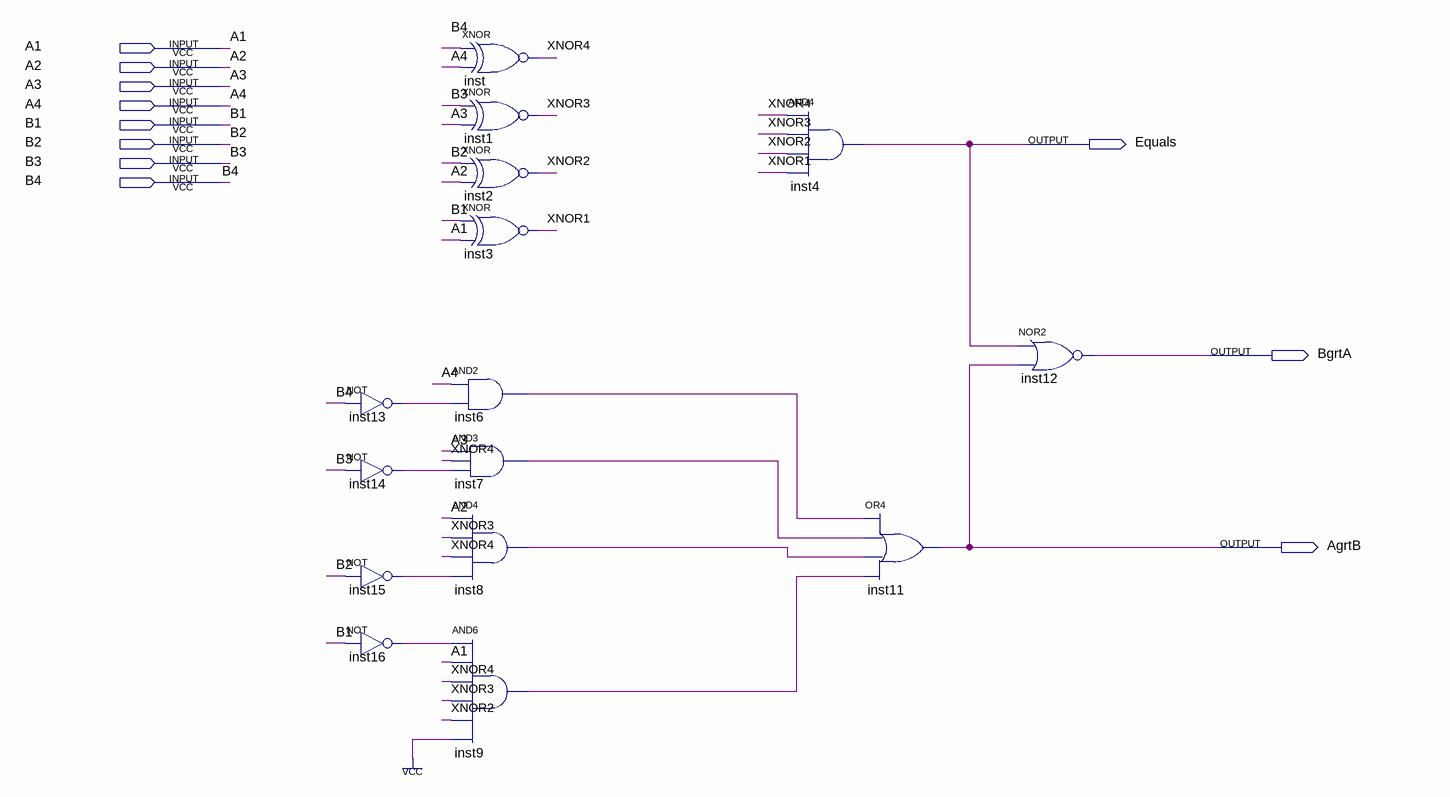
[diagram p0: schematic sheet]
// Quartus schematic aula13.bdf as structural Verilog: 15 symbols, 11 pins
module aula13 (
  input  A1,
  input  A2,
  input  A3,
  input  A4,
  input  B1,
  input  B2,
  input  B3,
  input  B4,
  output Equals,
  output BgrtA,
  output AgrtB
);

  wire inst6_out, inst7_out, inst8_out, inst9_out, inst13_out, inst14_out, inst15_out, inst16_out, XNOR1,
       XNOR2, XNOR3, XNOR4;

  not inst13 (inst13_out, B4);
  not inst14 (inst14_out, B3);
  not inst15 (inst15_out, B2);
  not inst16 (inst16_out, B1);
  xnor inst (XNOR4, B4, A4);
  xnor inst1 (XNOR3, B3, A3);
  xnor inst2 (XNOR2, B2, A2);
  xnor inst3 (XNOR1, B1, A1);
  and inst6 (inst6_out, A4, inst13_out);
  and inst7 (inst7_out, A3, XNOR4, inst14_out);
  and inst8 (inst8_out, A2, XNOR3, XNOR4, inst15_out);
  and inst9 (inst9_out, inst16_out, A1, XNOR4, XNOR3, XNOR2, 1'b1);
  and inst4 (Equals, XNOR4, XNOR3, XNOR2, XNOR1);
  or inst11 (AgrtB, inst6_out, inst7_out, inst8_out, inst9_out);
  nor inst12 (BgrtA, Equals, AgrtB);
endmodule
